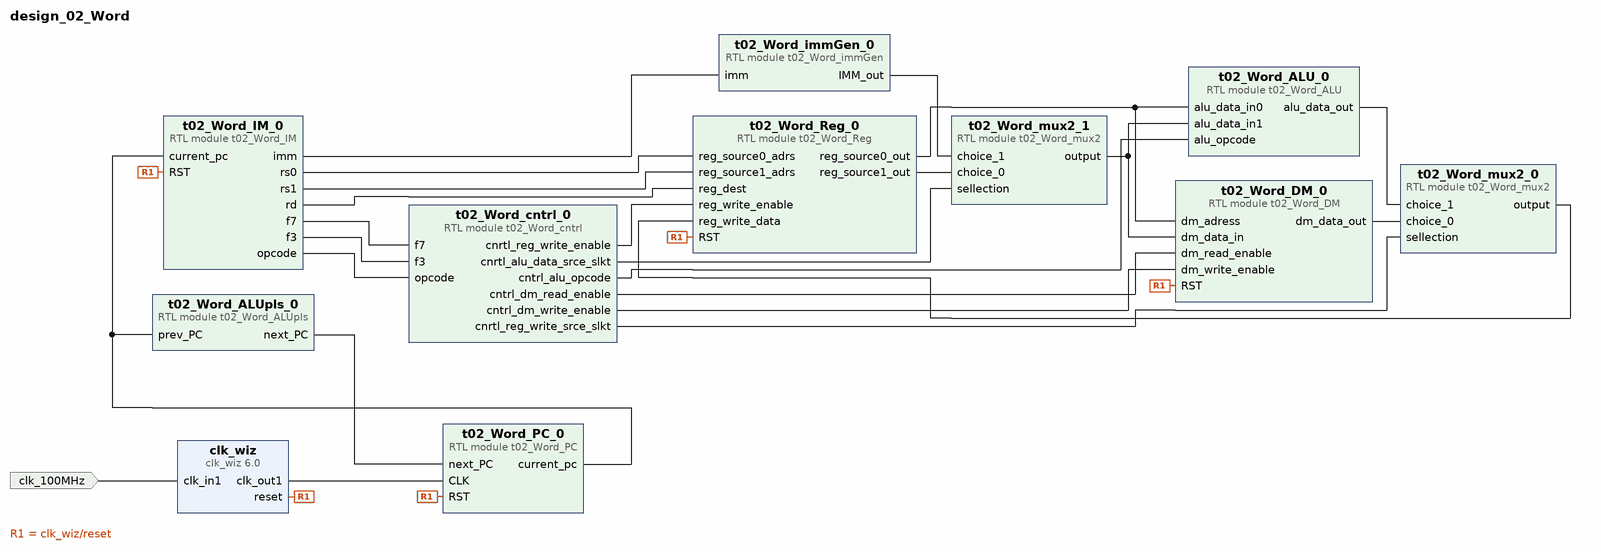
[diagram p0: block diagram of the top level]
# Vivado block design design_02_Word, xcku040-ffva1156-2-e, Vivado 2020.1
create_bd_design design_02_Word

create_bd_port -dir I -type clk clk_100MHz
set_property -dict {CONFIG.FREQ_HZ 100000000} [get_bd_ports clk_100MHz]

create_bd_cell -type ip -vlnv xilinx.com:ip:clk_wiz:6.0 clk_wiz
create_bd_cell -type module -reference t02_Word_ALU t02_Word_ALU_0
create_bd_cell -type module -reference t02_Word_ALUpls t02_Word_ALUpls_0
create_bd_cell -type module -reference t02_Word_IM t02_Word_IM_0
create_bd_cell -type module -reference t02_Word_PC t02_Word_PC_0
create_bd_cell -type module -reference t02_Word_Reg t02_Word_Reg_0
create_bd_cell -type module -reference t02_Word_cntrl t02_Word_cntrl_0
create_bd_cell -type module -reference t02_Word_immGen t02_Word_immGen_0
create_bd_cell -type module -reference t02_Word_mux2 t02_Word_mux2_0
create_bd_cell -type module -reference t02_Word_mux2 t02_Word_mux2_1
create_bd_cell -type module -reference t02_Word_DM t02_Word_DM_0

# ---- connections ----

connect_bd_net [get_bd_pins t02_Word_IM_0/f7] [get_bd_pins t02_Word_cntrl_0/f7]
connect_bd_net [get_bd_pins t02_Word_IM_0/f3] [get_bd_pins t02_Word_cntrl_0/f3]
connect_bd_net [get_bd_pins t02_Word_IM_0/opcode] [get_bd_pins t02_Word_cntrl_0/opcode]
connect_bd_net [get_bd_pins t02_Word_IM_0/rs0] [get_bd_pins t02_Word_Reg_0/reg_source0_adrs]
connect_bd_net [get_bd_pins t02_Word_IM_0/rs1] [get_bd_pins t02_Word_Reg_0/reg_source1_adrs]
connect_bd_net [get_bd_pins t02_Word_IM_0/rd] [get_bd_pins t02_Word_Reg_0/reg_dest]
connect_bd_net [get_bd_pins t02_Word_cntrl_0/cnrtl_reg_write_enable] [get_bd_pins t02_Word_Reg_0/reg_write_enable]
connect_bd_net [get_bd_pins t02_Word_Reg_0/reg_source0_out] [get_bd_pins t02_Word_ALU_0/alu_data_in0] [get_bd_pins t02_Word_DM_0/dm_adress]
connect_bd_net [get_bd_pins t02_Word_cntrl_0/cntrl_alu_opcode] [get_bd_pins t02_Word_ALU_0/alu_opcode]
connect_bd_net [get_bd_pins t02_Word_ALU_0/alu_data_out] [get_bd_pins t02_Word_mux2_0/choice_1]
connect_bd_net [get_bd_pins t02_Word_cntrl_0/cntrl_dm_read_enable] [get_bd_pins t02_Word_DM_0/dm_read_enable]
connect_bd_net [get_bd_pins t02_Word_cntrl_0/cntrl_dm_write_enable] [get_bd_pins t02_Word_DM_0/dm_write_enable]
connect_bd_net [get_bd_pins t02_Word_mux2_0/output] [get_bd_pins t02_Word_Reg_0/reg_write_data]
connect_bd_net [get_bd_pins t02_Word_DM_0/dm_data_out] [get_bd_pins t02_Word_mux2_0/choice_0]
connect_bd_net [get_bd_pins t02_Word_cntrl_0/cnrtl_reg_write_srce_slkt] [get_bd_pins t02_Word_mux2_0/sellection]
connect_bd_net [get_bd_pins t02_Word_IM_0/imm] [get_bd_pins t02_Word_immGen_0/imm]
connect_bd_net [get_bd_pins t02_Word_immGen_0/IMM_out] [get_bd_pins t02_Word_mux2_1/choice_1]
connect_bd_net [get_bd_pins t02_Word_Reg_0/reg_source1_out] [get_bd_pins t02_Word_mux2_1/choice_0]
connect_bd_net [get_bd_pins t02_Word_mux2_1/output] [get_bd_pins t02_Word_ALU_0/alu_data_in1] [get_bd_pins t02_Word_DM_0/dm_data_in]
connect_bd_net [get_bd_pins t02_Word_cntrl_0/cnrtl_alu_data_srce_slkt] [get_bd_pins t02_Word_mux2_1/sellection]
connect_bd_net [get_bd_pins t02_Word_PC_0/current_pc] [get_bd_pins t02_Word_ALUpls_0/prev_PC] [get_bd_pins t02_Word_IM_0/current_pc]
connect_bd_net [get_bd_pins t02_Word_ALUpls_0/next_PC] [get_bd_pins t02_Word_PC_0/next_PC]
connect_bd_net [get_bd_pins clk_wiz/clk_out1] [get_bd_pins t02_Word_PC_0/CLK]
connect_bd_net [get_bd_ports clk_100MHz] [get_bd_pins clk_wiz/clk_in1]
connect_bd_net [get_bd_pins clk_wiz/reset] \
  [get_bd_pins t02_Word_IM_0/RST] [get_bd_pins t02_Word_PC_0/RST] [get_bd_pins t02_Word_Reg_0/RST] \
  [get_bd_pins t02_Word_DM_0/RST]

validate_bd_design
save_bd_design
